# EAGLE schematic blinkencontrol (EAGLE 6.5.0)
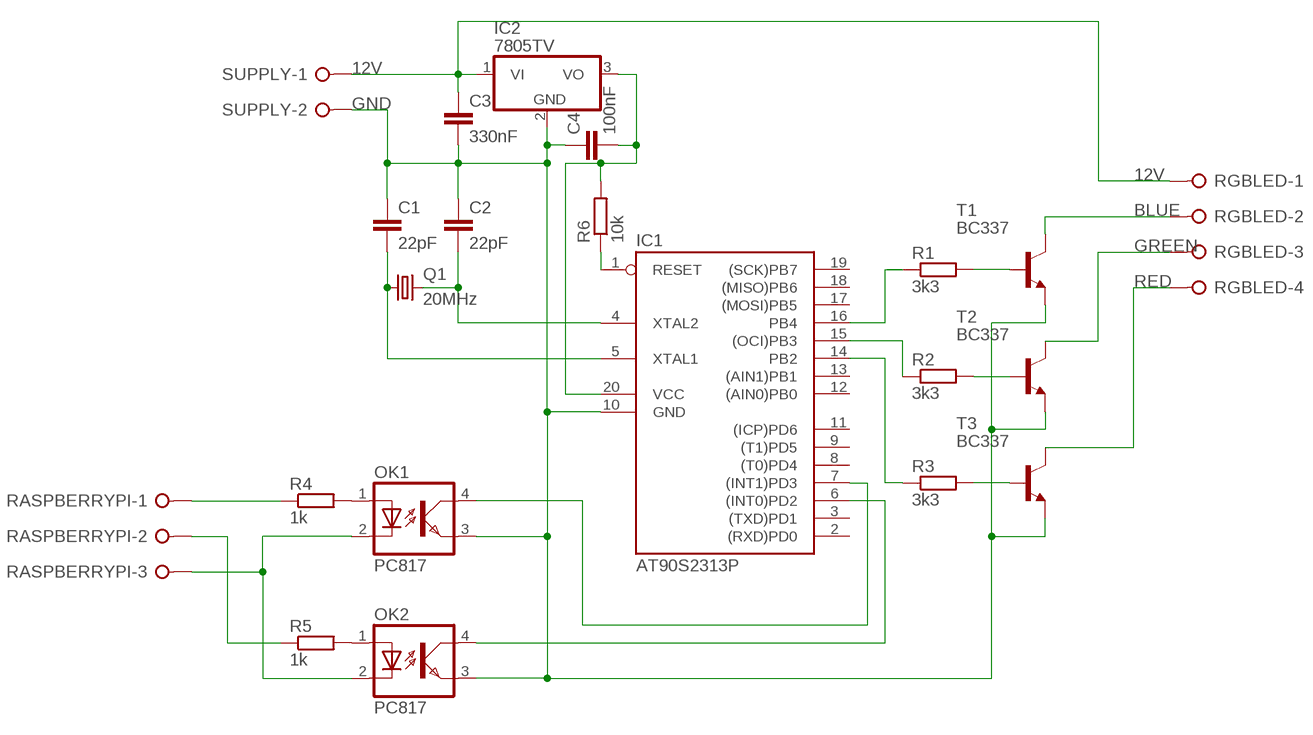
[diagram p0: schematic, sheet 1]

## Parts
C1  22pF  C2.5/2  [C2.5-2]
C2  22pF  C2.5/2  [C2.5-2]
C3  330nF  C2,5-3  [C2.5-3]
C4  100nF  C2,5-3  [C2.5-3]
IC1  AT90S2313P  [DIL20]
IC2  7805TV  [TO220V]
OK1  PC817  [DIL04]
OK2  PC817  [DIL04]
Q1  20MHz  CRYSTALHC49U-V  [HC49U-V]
R1  3k3  R-EU_0207/10  [0207/10]
R2  3k3  R-EU_0207/10  [0207/10]
R3  3k3  R-EU_0207/10  [0207/10]
R4  1k  R-EU_0207/10  [0207/10]
R5  1k  R-EU_0207/10  [0207/10]
R6  10k  R-EU_0207/12  [0207/12]
RASPBERRYPI  W237-3E  [W237-3E]
RGBLED  W237-04P  [W237-4P]
SUPPLY  W237-02P  [W237-132]
T1  BC337  BC337-40-NPN-TO92-CBE  [TO92-CBE]
T2  BC337  BC337-40-NPN-TO92-CBE  [TO92-CBE]
T3  BC337  BC337-40-NPN-TO92-CBE  [TO92-CBE]

## Nets
5V0: C4.2 IC1.20(VCC) IC2.3(VO) R6.2
12V: C3.1 IC2.1(VI) RGBLED.1 SUPPLY.1
BLUE: RGBLED.2 T1.C
GND: C1.1 C2.1 C3.2 C4.1 IC1.10(GND) IC2.2(GND) OK1.3(EMIT) OK2.3(EMIT) SUPPLY.2 T1.E T2.E T3.E
GREEN: RGBLED.3 T2.C
N$3: IC1.1(RESET) R6.1
N$4: C2.2 IC1.4(XTAL2) Q1.2
N$5: C1.2 IC1.5(XTAL1) Q1.1
N$6: R1.2 T1.B
N$7: R2.2 T2.B
N$8: R3.2 T3.B
N$9: IC1.7((INT1)PD3) OK1.4(COL)
N$10: IC1.16(PB4) R1.1
N$11: IC1.15((OCI)PB3) R2.1
N$12: IC1.14(PB2) R3.1
N$13: IC1.6((INT0)PD2) OK2.4(COL)
N$14: OK1.1(A) R4.2
N$15: OK2.1(A) R5.2
N$16: R4.1 RASPBERRYPI.1
N$17: R5.1 RASPBERRYPI.2
N$18: OK1.2(C) OK2.2(C) RASPBERRYPI.3
RED: RGBLED.4 T3.C
Unconnected: IC1.2((RXD)PD0) IC1.3((TXD)PD1) IC1.8((T0)PD4) IC1.9((T1)PD5) IC1.11((ICP)PD6) IC1.12((AIN0)PB0) IC1.13((AIN1)PB1) IC1.17((MOSI)PB5) IC1.18((MISO)PB6) IC1.19((SCK)PB7)

## Library data of the parts
C1-C4 = capacitor-wima:C: CAPACITOR naming: grid - package width
IC1 = atmel:AT90S2313: MICROCONTROLLER 2 Kbytes FLASH 128 bytes SRAM 128 bytes EEPROM UART; OC_FARNELL: unknown; OC_NEWARK: unknown
IC2 = linear:78*: Positive VOLTAGE REGULATOR Source: http://cache.national.com/ds/LM/LM78L05.pdf http://www.fairchildsemi.com/ds/LM/LM7805.pdf
OK1 OK2 = optocoupler:PC817: SHARP OPTO COUPLER; MPN: PC817X4J000F; OC_FARNELL: 9707727; OC_NEWARK: 97K7059
Q1 = crystal:CRYSTAL: CRYSTAL; OC_FARNELL: 1666969; OC_NEWARK: unknown
R1-R6 = resistor:R-EU_: RESISTOR, European symbol
RASPBERRYPI = con-wago-508:W237-3E: WAGO SREW CLAMP; OC_FARNELL: unknown; OC_NEWARK: unknown
RGBLED = con-wago-508:W237-04P: WAGO SREW CLAMP; OC_FARNELL: unknown; OC_NEWARK: unknown
SUPPLY = con-wago-508:W237-02P: WAGO SREW CLAMP; OC_FARNELL: unknown; OC_NEWARK: unknown
T1-T3 = transistor:*-NPN-: NPN Transistror BF959 corrected 2008.03.06